# EAGLE schematic untitled (EAGLE 9.6.2)
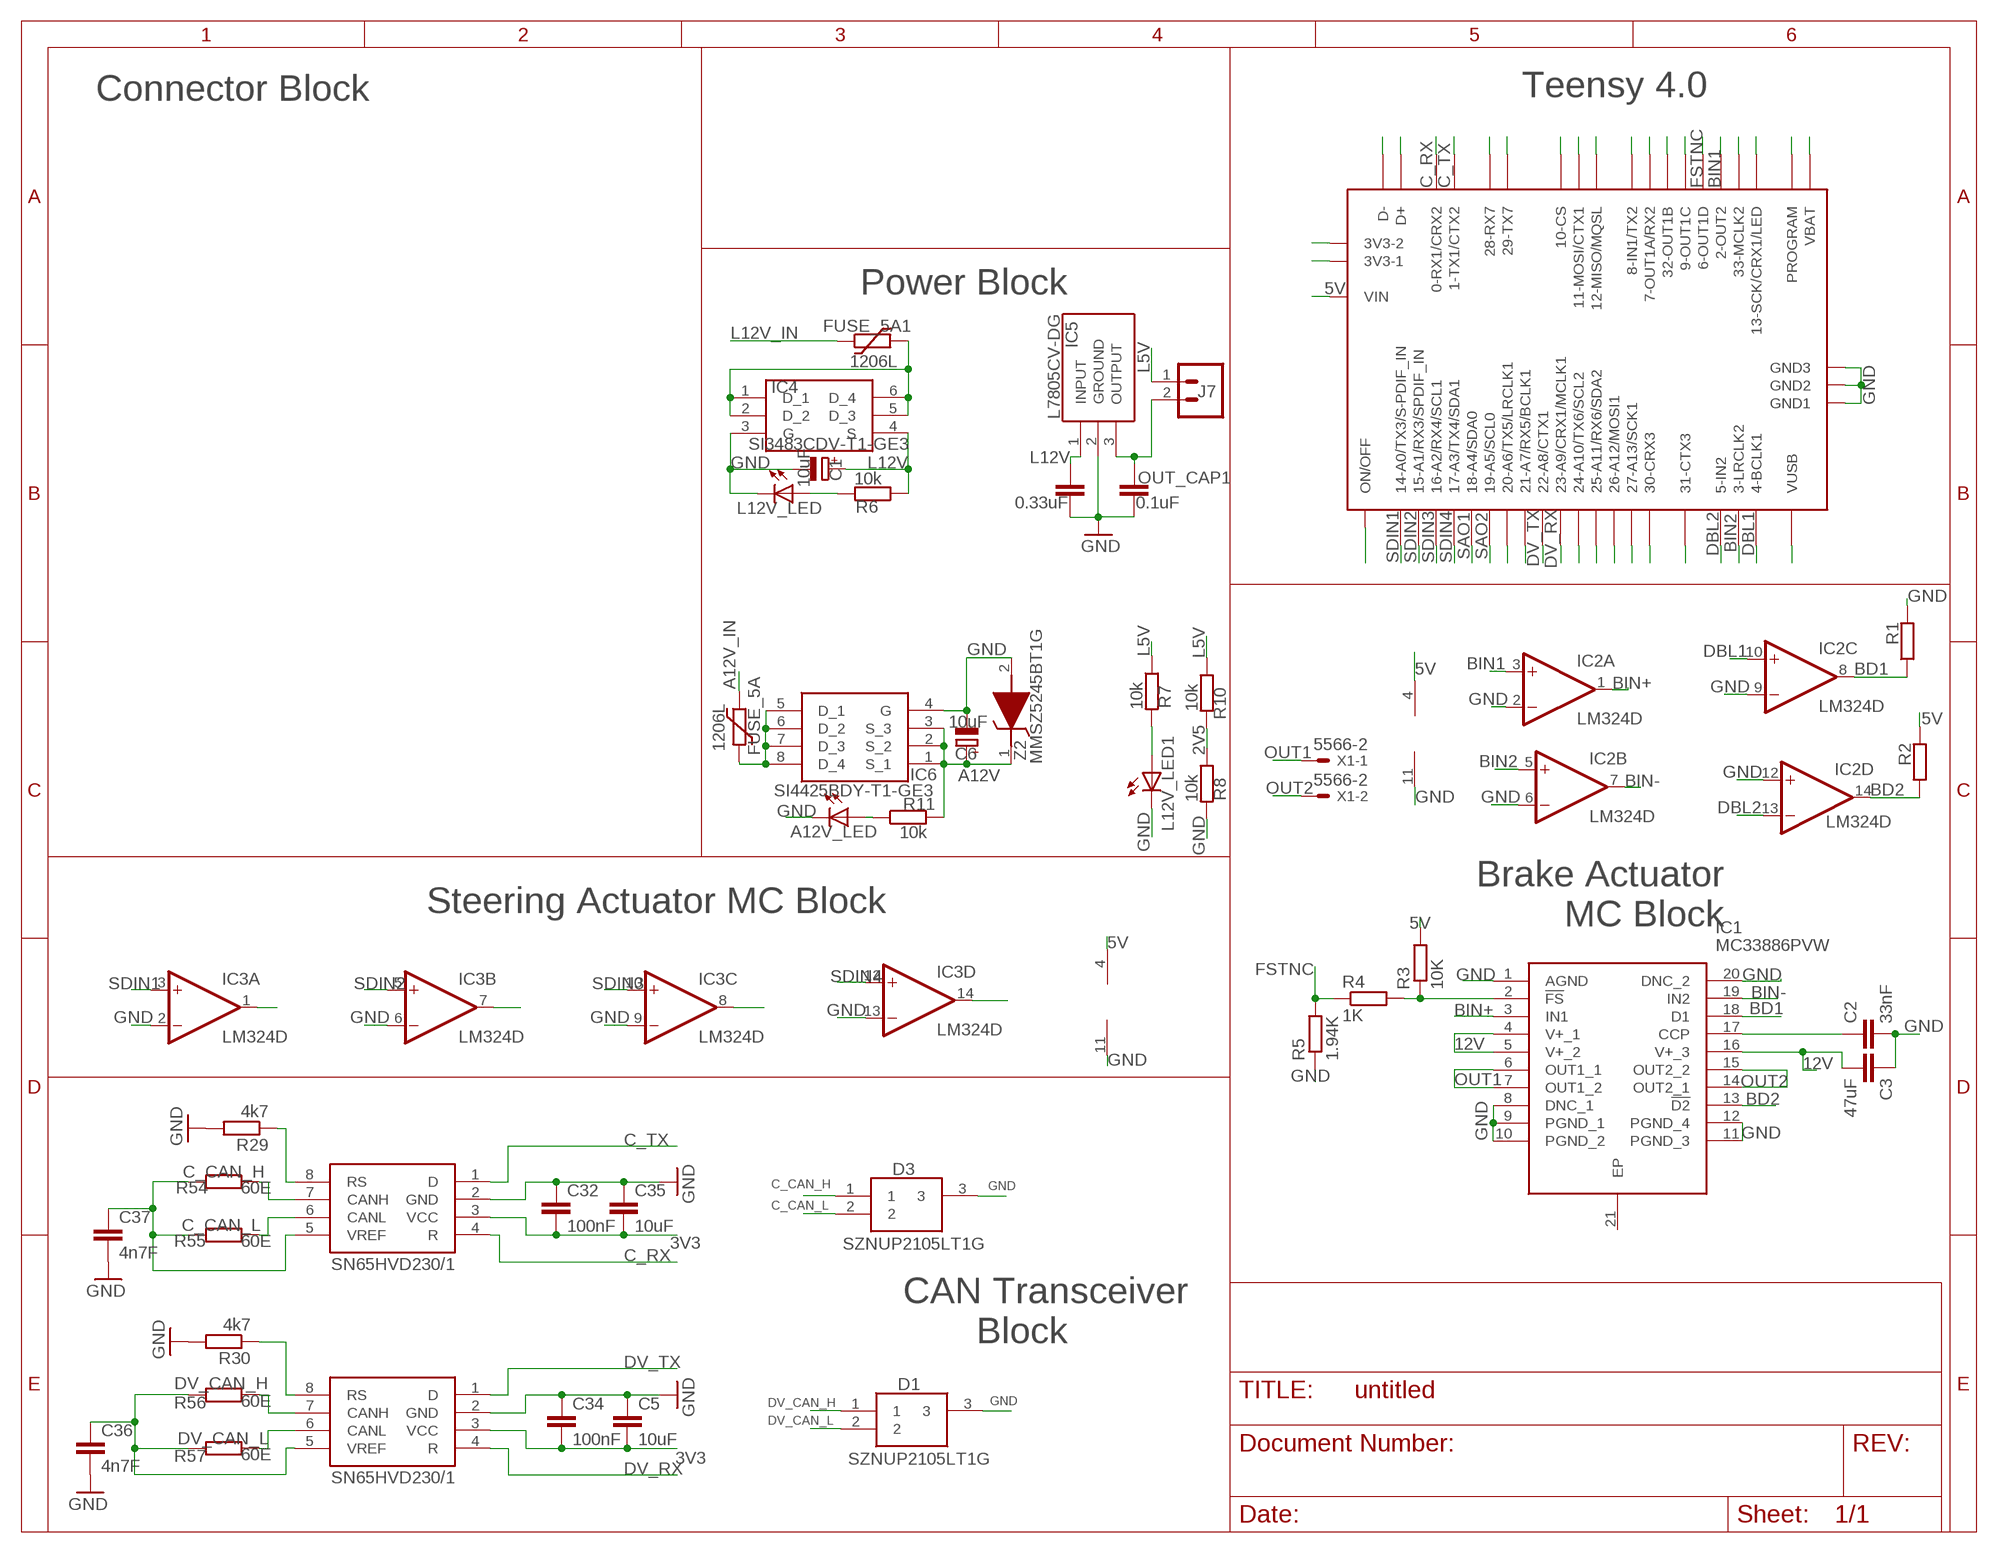
[diagram p0: schematic, sheet 1]

## Parts
A12V_LED  LED1206  [LED-1206]
C1  10uF  CPOL-EUE2.5-6  [E2,5-6]
C2  33nF  C-EUC0805  [C0805]
C3  47uF  C-EUC1206  [C1206]
C5  10uF  C-EUC0805  [C0805]
C6  10uF  CPOL-EUE2.5-6  [E2,5-6]
C32  100nF  C-EUC0805  [C0805]
C34  100nF  C-EUC0805  [C0805]
C35  10uF  C-EUC0805  [C0805]
C36  4n7F  C-EUC0805  [C0805]
C37  4n7F  C-EUC0805  [C0805]
D1  SZNUP2105LT1G  [SOT96P237X111-3N]
D3  SZNUP2105LT1G  [SOT96P237X111-3N]
FUSE_5A  1206L  [1206L]
FUSE_5A1  1206L  [1206L]
IC1  MC33886PVW  [SOIC127P1420X340-21N]
IC2  LM324D  [SO14]
IC3  LM324D  [SO14]
IC4  SI3483CDV-T1-GE3  [SOP95P284X110-6N]
IC5  L7805CV-DG  [TO255P460X1020X2008-3P]
IC6  SI4425BDY-T1-GE3  [SOIC127P600X175-8N]
IN_CAP1  0.33uF  C-EUC0805  [C0805]
J7  CONN_02  [1X02]
L12V_LED  LED1206  [LED-1206]
L12V_LED1  LED1206  [LED-1206]
OUT_CAP1  0.1uF  C-EUC0805  [C0805]
R1  R-EU_R0805  [R0805]
R2  R-EU_R0805  [R0805]
R3  10K  R-EU_R0805  [R0805]
R4  1K  R-EU_R0805  [R0805]
R5  1.94K  R-EU_R0805  [R0805]
R6  10k  R-EU_R0805  [R0805]
R7  10k  R-EU_R0805  [R0805]
R8  10k  R-EU_R0805  [R0805]
R10  10k  R-EU_R0805  [R0805]
R11  10k  R-EU_R0805  [R0805]
R29  4k7  R-EU_R0805  [R0805]
R30  4k7  R-EU_R0805  [R0805]
R54  60E  R-EU_R0805  [R0805]
R55  60E  R-EU_R0805  [R0805]
R56  60E  R-EU_R0805  [R0805]
R57  60E  R-EU_R0805  [R0805]
U$1  TEENSY40  [TEENSY40]
U$7  SN65HVD230/1  [SO8]
U$8  SN65HVD230/1  [SO8]
X1  5566-2  [5566-2]
Z2  MMSZ5245BT1G  [SOD3716X135N]

## Nets
2V5: R8.1 R10.2
3V3: C5.2 C32.2 C34.2 C35.2 U$7.3(VCC) U$8.3(VCC)
5V: IC2.4(P:V+) IC3.4(P:V+) R2.2 R3.2 U$1.VIN
12V: C3.2 IC1.4(V+_1) IC1.5(V+_2) IC1.16(V+_3)
A12V: C6.+ IC6.1(S_1) IC6.2(S_2) IC6.3(S_3) R11.2 Z2.1(K)
A12V_IN: FUSE_5A.P$1
BD1: IC1.18(D1) IC2.8(C:OUT) R1.1
BD2: IC1.13(!D2) IC2.14(D:OUT) R2.1
BIN1: IC2.3(A:+IN) U$1.2-OUT2
BIN2: IC2.5(B:+IN) U$1.3-LRCLK2
BIN+: IC1.3(IN1) IC2.1(A:OUT)
BIN-: IC1.19(IN2) IC2.7(B:OUT)
C_CAN_H: D3.1 R54.1 U$8.7(CANH)
C_CAN_L: D3.2 R55.1 U$8.6(CANL)
C_RX: U$1.0-RX1(0-RX1/CRX2) U$8.4(R)
C_TX: U$1.1-TX1(1-TX1/CTX2) U$8.1(D)
DBL1: IC2.10(C:+IN) U$1.4-BCLK2(4-BCLK1)
DBL2: IC2.13(D:-IN) U$1.5-IN2
DV_CAN_H: D1.1 R56.1 U$7.7(CANH)
DV_CAN_L: D1.2 R57.1 U$7.6(CANL)
DV_RX: U$1.23-A9/CRX1/CCLK1(23-A9/CRX1/MCLK1) U$7.4(R)
DV_TX: U$1.22-A8/CTX1 U$7.1(D)
FSTNC: R4.1 R5.2 U$1.6-OUT1D
GND: A12V_LED.C C1.- C2.2 C3.1 C5.1 C6.- C32.1 C34.1 C35.1 C36.2 C37.2 D1.3 D3.3 IC1.1(AGND) IC1.8(DNC_1) IC1.9(PGND_1) IC1.10(PGND_2) IC1.11(PGND_3) IC1.12(PGND_4) IC1.20(DNC_2) IC2.2(A:-IN) IC2.6(B:-IN) IC2.9(C:-IN) IC2.11(P:V-) IC2.12(D:+IN) IC3.2(A:-IN) IC3.6(B:-IN) IC3.9(C:-IN) IC3.11(P:V-) IC3.13(D:-IN) IC4.3(G) IC5.2(GROUND) IC6.4(G) IN_CAP1.2 L12V_LED1.C L12V_LED.C OUT_CAP1.2 R1.2 R5.1 R8.2 R29.2 R30.2 U$1.GND1 U$1.GND2 U$1.GND3 U$7.2(GND) U$8.2(GND) Z2.2(A)
L5V: J7.1 R7.1 R10.1
L12V: C1.+ IC4.4(S) IC5.1(INPUT) IN_CAP1.1 R6.1
L12V_IN: FUSE_5A1.P$1
N$1: R29.1 U$8.8(RS)
N$2: C37.1 R54.2 R55.2 U$8.5(VREF)
N$3: IC3.1(A:OUT)
N$4: R30.1 U$7.8(RS)
N$5: IC1.2(!FS) R3.1 R4.2
N$6: FUSE_5A1.P$2 IC4.1(D_1) IC4.2(D_2) IC4.5(D_3) IC4.6(D_4)
N$7: C2.1 IC1.17(CCP)
N$8: IC3.7(B:OUT)
N$9: L12V_LED.A R6.2
N$11: IC3.8(C:OUT)
N$12: U$1.20-A6/TX5/LRCLK1
N$13: U$1.21-A7/RX5/BCLK1
N$14: IC3.14(D:OUT)
N$16: IC5.3(OUTPUT) J7.2 OUT_CAP1.1
N$17: U$1.24-A10/TX6/SCL2
N$18: U$1.25-A11/SDA2(25-A11/RX6/SDA2)
N$19: U$1.26-A12/MOSI1
N$20: U$1.27-A13/SCK1
N$21: U$1.30-CRX3
N$22: U$1.31-CTX3
N$23: FUSE_5A.P$2 IC6.5(D_1) IC6.6(D_2) IC6.7(D_3) IC6.8(D_4)
N$24: L12V_LED1.A R7.2
N$25: A12V_LED.A R11.1
N$26: U$1.VUSB
N$30: U$1.VBAT
N$31: U$1.PROGRAM
N$32: U$1.13-SCK/CRX1/LED
N$33: U$1.33-MCLK2
N$35: C36.1 R56.2 R57.2 U$7.5(VREF)
N$36: U$1.9-OUT1C
N$37: U$1.32-OUTB1(32-OUT1B)
N$38: U$1.7-RX2/OUT1A(7-OUT1A/RX2)
N$39: U$1.8-TX2/IN1(8-IN1/TX2)
N$40: U$1.12-MIO/MQSL(12-MISO/MQSL)
N$41: U$1.11-MOSI/CTX1
N$42: U$1.10-CS/MQSR(10-CS)
N$43: U$1.29-TX7
N$44: U$1.28-RX7
N$47: U$1.D+
N$48: U$1.D-
N$49: U$1.3V3-2
N$50: U$1.3V3-1
N$52: U$1.ON/OFF
OUT1: IC1.6(OUT1_1) IC1.7(OUT1_2) X1.1
OUT2: IC1.14(OUT2_1) IC1.15(OUT2_2) X1.2
SAO1: U$1.18-A4/SDA0
SAO2: U$1.19-A5/SCL0
SDIN1: IC3.3(A:+IN) U$1.14-A0/TX3/S-PFI_OUT(14-A0/TX3/S-PDIF_IN)
SDIN2: IC3.5(B:+IN) U$1.15-A1/RX3/S-PDIF_IN(15-A1/RX3/SPDIF_IN)
SDIN3: IC3.10(C:+IN) U$1.16-A2/RX4/SCL1
SDIN4: IC3.12(D:+IN) U$1.17-A3/TX4/SDA1
Unconnected: IC1.21(EP)

## Notes on the sheet
- Connector Block | Teensy 4.0
- Power Block
- Brake Actuator
     MC Block
- Steering Actuator MC Block
- CAN Transceiver 
         Block

## Library data of the parts
A12V_LED L12V_LED L12V_LED1 = SparkFun-LED:LED: LEDs Standard schematic elements and footprints for 5mm, 3mm, 1206, and 0603 sized LEDs. 5mm - Spark Fun Electronics SKU : COM-00529 (and others)
C1 C6 = IIT_BOMBAY_Racing:CPOL-EU: POLARIZED CAPACITOR, European symbol
C2 C3 = rcl:C-EU: CAPACITOR, European symbol; SPICEPREFIX: C
C5 C32 C34-C37 IN_CAP1 OUT_CAP1 = IIT_BOMBAY_Racing:C-EU: CAPACITOR, European symbol
D1 D3 = SamacSys_Parts:SZNUP2105LT1G: Dual Bi-Directional TVS Diode, 350W peak, 3-pin SOT-23 Source: Datasheet <http://www.onsemi.com/pub/Collateral/NUP2105L-D.PDF>; DESCRIPTION: Dual Bi-Directional TVS Diode, 350W peak, 3-pin SOT-23; HEIGHT: 1.11mm; MANUFACTURER_NAME: ON Semiconductor; MANUFACTURER_PART_NUMBER: SZNUP2105LT1G; MOUSER_PART_NUMBER: 863-SZNUP2105LT1G; MOUSER_PRICE-STOCK: https://www.mouser.co.uk/ProductDetail/ON-Semiconductor/SZNUP2105LT1G?qs=PJJcWtbOkNWqqZbXH80dfQ%3D%3D
FUSE_5A FUSE_5A1 = IIT_BOMBAY_Racing:1206L
IC1 = MC33886PVW:MC33886PVW: Motor / Motion / Ignition Controllers & Drivers 5.0 A H-BRIDGE Source: Datasheet <https://www.mouser.com/datasheet/2/302/MC33886-1126782.pdf>; ARROW_PART_NUMBER: MC33886PVW; ARROW_PRICE-STOCK: https://www.arrow.com/en/products/mc33886pvw/nxp-semiconductors?region=nac; DESCRIPTION: Motor / Motion / Ignition Controllers & Drivers 5.0 A H-BRIDGE; HEIGHT: 3.4mm; MANUFACTURER_NAME: NXP; MANUFACTURER_PART_NUMBER: MC33886PVW; MOUSER_PART_NUMBER: 841-MC33886PVW; MOUSER_PRICE-STOCK: https://www.mouser.co.uk/ProductDetail/NXP-Semiconductors/MC33886PVW?qs=NnG%2FAzKRagm1nCHuxlQnOA%3D%3D
IC2 IC3 = linear:LM324: OP AMP
IC4 = SI3483CDV-T1-GE3:SI3483CDV-T1-GE3: MOSFETs -30V Vds 20V Vgs TSOP-6 Source: Datasheet <http://www.vishay.com/docs/68603/si3483cd.pdf>; ARROW_PART_NUMBER: SI3483CDV-T1-GE3; ARROW_PRICE-STOCK: https://www.arrow.com/en/products/si3483cdv-t1-ge3/vishay?region=nac; DESCRIPTION: MOSFETs -30V Vds 20V Vgs TSOP-6; HEIGHT: 1.1mm; MANUFACTURER_NAME: Vishay; MANUFACTURER_PART_NUMBER: SI3483CDV-T1-GE3; MOUSER_PART_NUMBER: 781-SI3483CDV-GE3; MOUSER_PRICE-STOCK: https://www.mouser.co.uk/ProductDetail/Vishay-Semiconductors/SI3483CDV-T1-GE3?qs=%252BPu8jn5UVnGPAGaYoTFBhA%3D%3D
IC5 = SamacSys_Parts:L7805CV-DG: Voltage Regulator 5V 4% 1.5A TO220 L7805CV-DG, Linear Voltage Regulator, Current Limit, Shut-Down 1.5A 5 V, 3-Pin TO220 Source: Datasheet <http://www.st.com/web/en/resource/technical/document/datasheet/CD00000444.pdf>; DESCRIPTION: Voltage Regulator 5V 4% 1.5A TO220 L7805CV-DG, Linear Voltage Regulator, Current Limit, Shut-Down 1.5A 5 V, 3-Pin TO220; HEIGHT: 4.6mm; MANUFACTURER_NAME: STMicroelectronics; MANUFACTURER_PART_NUMBER: L7805CV-DG; MOUSER_PART_NUMBER: 511-L7805CV-DG; MOUSER_PRICE-STOCK: https://www.mouser.co.uk/ProductDetail/STMicroelectronics/L7805CV-DG?qs=T%2FOtf55vL7c3O0as9P9fAw%3D%3D
IC6 = SI4425BDY-T1-GE3:SI4425BDY-T1-GE3: MOSFET 30V 11.4A 2.5W 12mohm @ 10V Source: Datasheet <http://www.vishay.com/docs/72000/72000.pdf>; ARROW_PART_NUMBER: SI4425BDY-T1-GE3; ARROW_PRICE-STOCK: https://www.arrow.com/en/products/si4425bdy-t1-ge3/vishay?region=europe; DESCRIPTION: MOSFET 30V 11.4A 2.5W 12mohm @ 10V; HEIGHT: 1.75mm; MANUFACTURER_NAME: Vishay; MANUFACTURER_PART_NUMBER: SI4425BDY-T1-GE3; MOUSER_PART_NUMBER: 781-SI4425BDY-GE3; MOUSER_PRICE-STOCK: https://www.mouser.co.uk/ProductDetail/Vishay-Siliconix/SI4425BDY-T1-GE3?qs=ru2xu5lizsBP9AWL%2FocEWA%3D%3D
J7 = SparkFun-Connectors:CONN_02: Multi connection point. Often used as Generic Header-pin footprint for 0.1 inch spaced/style header connections On any of the 0.1 inch spaced packages, you can populate with these: Break Away Headers - Straight <https://www.sparkfun.com/products/116> (PRT-00116) Break Away Male Headers - Right Angle <https://www.sparkfun.com/products/553> (PRT-00553) Female Headers <https://www.sparkfun.com/products/115> (PRT-00115) Break Away Headers - Machine Pin <https://www.sparkfun.com/products/117> (PRT-00117) Break Away Female Headers - Swiss Machine Pin <https://www.sparkfun.com/products/743> (PRT-00743) For SCREWTERMINALS and SPRING TERMINALS visit here: Screw Terimnals on SparkFun.com <https://www.sparkfun.com/search/results?term=Screw+Terminals> (5mm/3.5mm/2.54mm spacing) This device is also useful as a general connection point to wire up your design to another part of your project. Our various solder wires solder well into these plated through hole pads. Hook-Up Wire - Assortment (Stranded, 22 AWG) <https://www.sparkfun.com/products/11375> (PRT-11375) Hook-Up Wire - Assortment (Solid Core, 22 AWG) <https://www.sparkfun.com/products/11367> (PRT-11367) View the entire wire category on our website here <https://www.sparkfun.com/categories/141> Special notes: Molex polarized connector foot print use with: PRT-08233 with associated crimp pins and housings. 2.54_SCREWTERM for use with PRT-10571. 3.5mm Screw Terminal footprints for PRT-08084 5mm Screw Terminal footprints for use with PRT-08432
R1-R5 = rcl:R-EU_: RESISTOR, European symbol; SPICEPREFIX: R
R6-R8 R10 R11 R29 R30 R54-R57 = IIT_BOMBAY_Racing:R-EU_: RESISTOR, European symbol
U$1 = teensy:TEENSY40: Teensy 4.0 device including POGO pins for pins 24 - 33, but not yet pins for D+ and D-. Symbol layout is what works for me and may not suite everyone... that can be added or additional symbols can be created to be used in a modilied davie name.
U$7 U$8 = texas_1:SN65HVD230/1
X1 = con-molex:5566-2: Mini FIT connector 2 pol Source: http://www.molex.com; MF: MOLEX; OC_FARNELL: 1822072; OC_NEWARK: unknown
Z2 = MMSZ5245BT1G:MMSZ5245BT1G: Zener Voltage Regulators%D 500 mW SOD???123 Surface Mount Source: Datasheet <https://datasheet.datasheetarchive.com/originals/distributors/Datasheets-SFU1/DSASFU100016857.pdf>; ARROW_PART_NUMBER: MMSZ5245BT1G; ARROW_PRICE-STOCK: https://www.arrow.com/en/products/mmsz5245bt1g/on-semiconductor?utm_currency=USD&region=nac; DESCRIPTION: Zener Voltage Regulators%D 500 mW SOD???123 Surface Mount; HEIGHT: 1.35mm; MANUFACTURER_NAME: onsemi; MANUFACTURER_PART_NUMBER: MMSZ5245BT1G; MOUSER_PART_NUMBER: 863-MMSZ5245BT1G; MOUSER_PRICE-STOCK: https://www.mouser.co.uk/ProductDetail/onsemi/MMSZ5245BT1G?qs=P4IOph%252Bbot9HHTEmCWuqOg%3D%3D